# Altium schematic sheet Power_LDO_5V.SchDoc: 5V LDO
size Letter; Engineer: Nathan Petersen; DocumentNumber: 9; Revision: v1.2; SheetNumber: 9; SheetTotal: 29
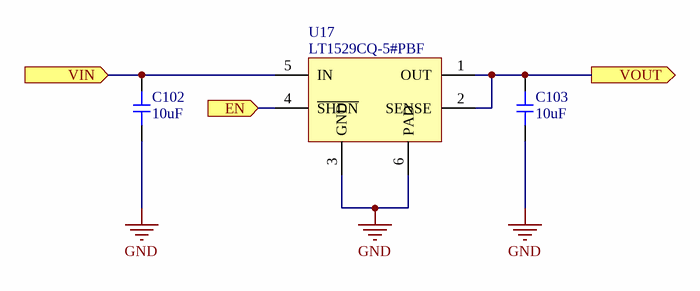
[diagram p0: Power_LDO_5V.SchDoc]

## Parts
C102  value 10uF  [0603-CAP]  (hidden comment: Capacitor)
C103  value 10uF  [0603-CAP]  (hidden comment: Capacitor)
U17  LT1529CQ-5#PBF  [5-DDPAK]

## Ports
EN (in), VIN (in), VOUT (out)

## Nets
GND: C102.2 C103.2 U17.3(GND) U17.6(PAD)
EN: U17.4(~{SHDN}) ; port EN
VIN: C102.1 U17.5(IN) ; port VIN
VOUT: C103.1 U17.1(OUT) U17.2(SENSE) ; port VOUT

## Notes on the sheet
- Title:
- File:
- Sheet:
- of
- Revision:
- Time:
- Date:
- Engineer:

## Library data of the parts
U17 = LT1529CQ-5#PBF: IC REG LINEAR 5V 3A 5DDPAK; Supplier 1: Digi-Key; Supplier Part Number 1: LT1529CQ-5#PBF-ND
C102 C103 = Capacitor: Supplier 1: Digi-Key; Supplier Part Number 1: 1276-1192-6-ND